# EAGLE design Digital_Output (EAGLE 7.2.0)
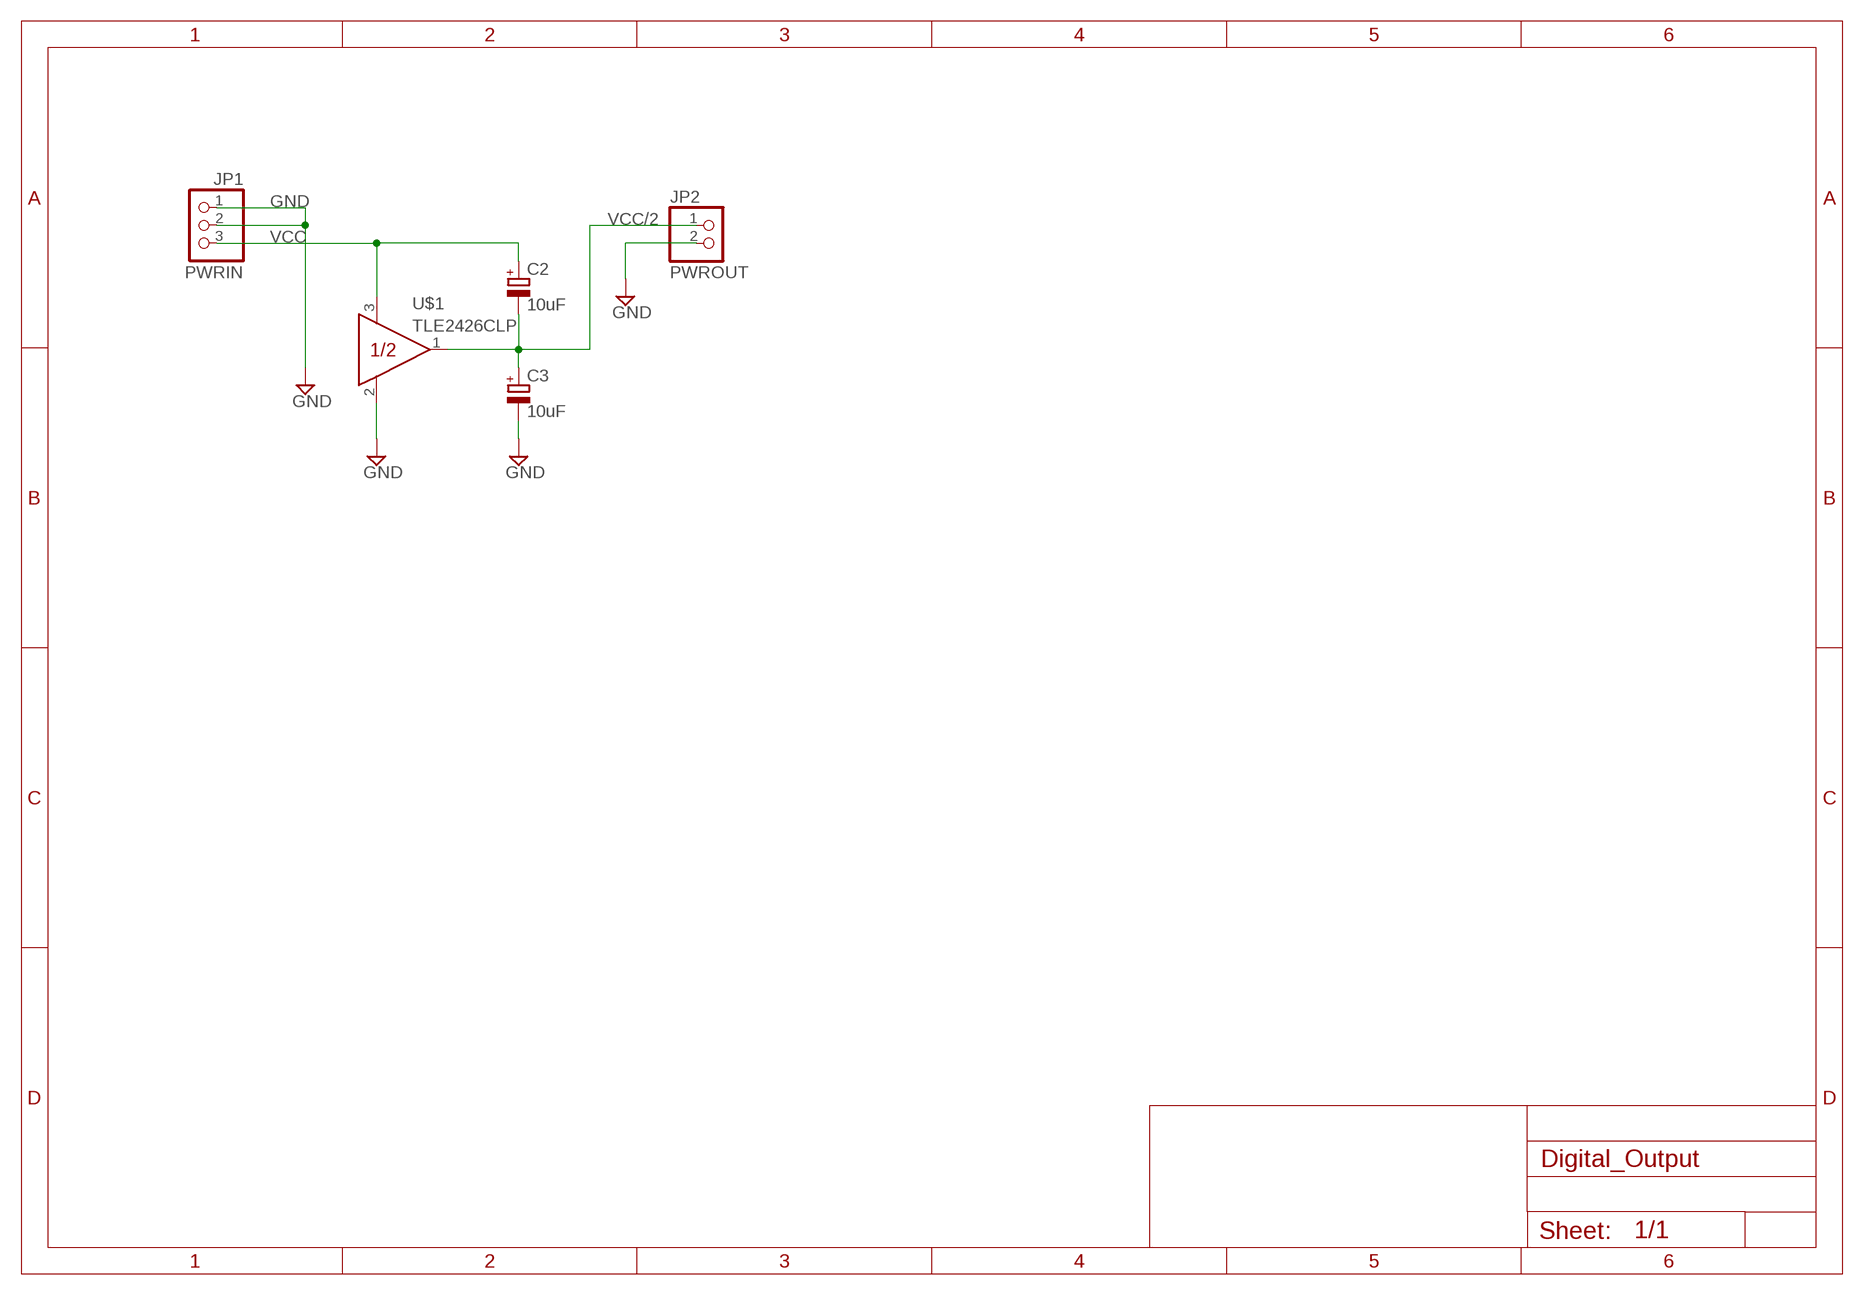
[diagram p0: schematic, sheet 1]

## Parts
C2  10uF  CPOL-EUE2.5-5  [E2,5-5]
C3  10uF  CPOL-EUE2.5-5  [E2,5-5]
JP1  PWRIN  PINHD-1X3  [1X03]
JP2  PWROUT  PINHD-1X2  [1X02]
U$1  TLE2426CLP  [TO226AA]

## Nets
GND: C3.- JP1.1 JP1.2 JP2.2 U$1.2(COM)
VCC: C2.+ JP1.3 U$1.3(IN)
VCC/2: C2.- C3.+ JP2.1 U$1.1(OUT)

## Library data of the parts
C2 C3 = rcl:CPOL-EU: POLARIZED CAPACITOR, European symbol
JP1 = pinhead:PINHD-1X3: PIN HEADER
JP2 = pinhead:PINHD-1X2: PIN HEADER
U$1 = tle2426:TLE2426*L: Texas Instruments "rail splitter". No noise-reduction pin.

## Board
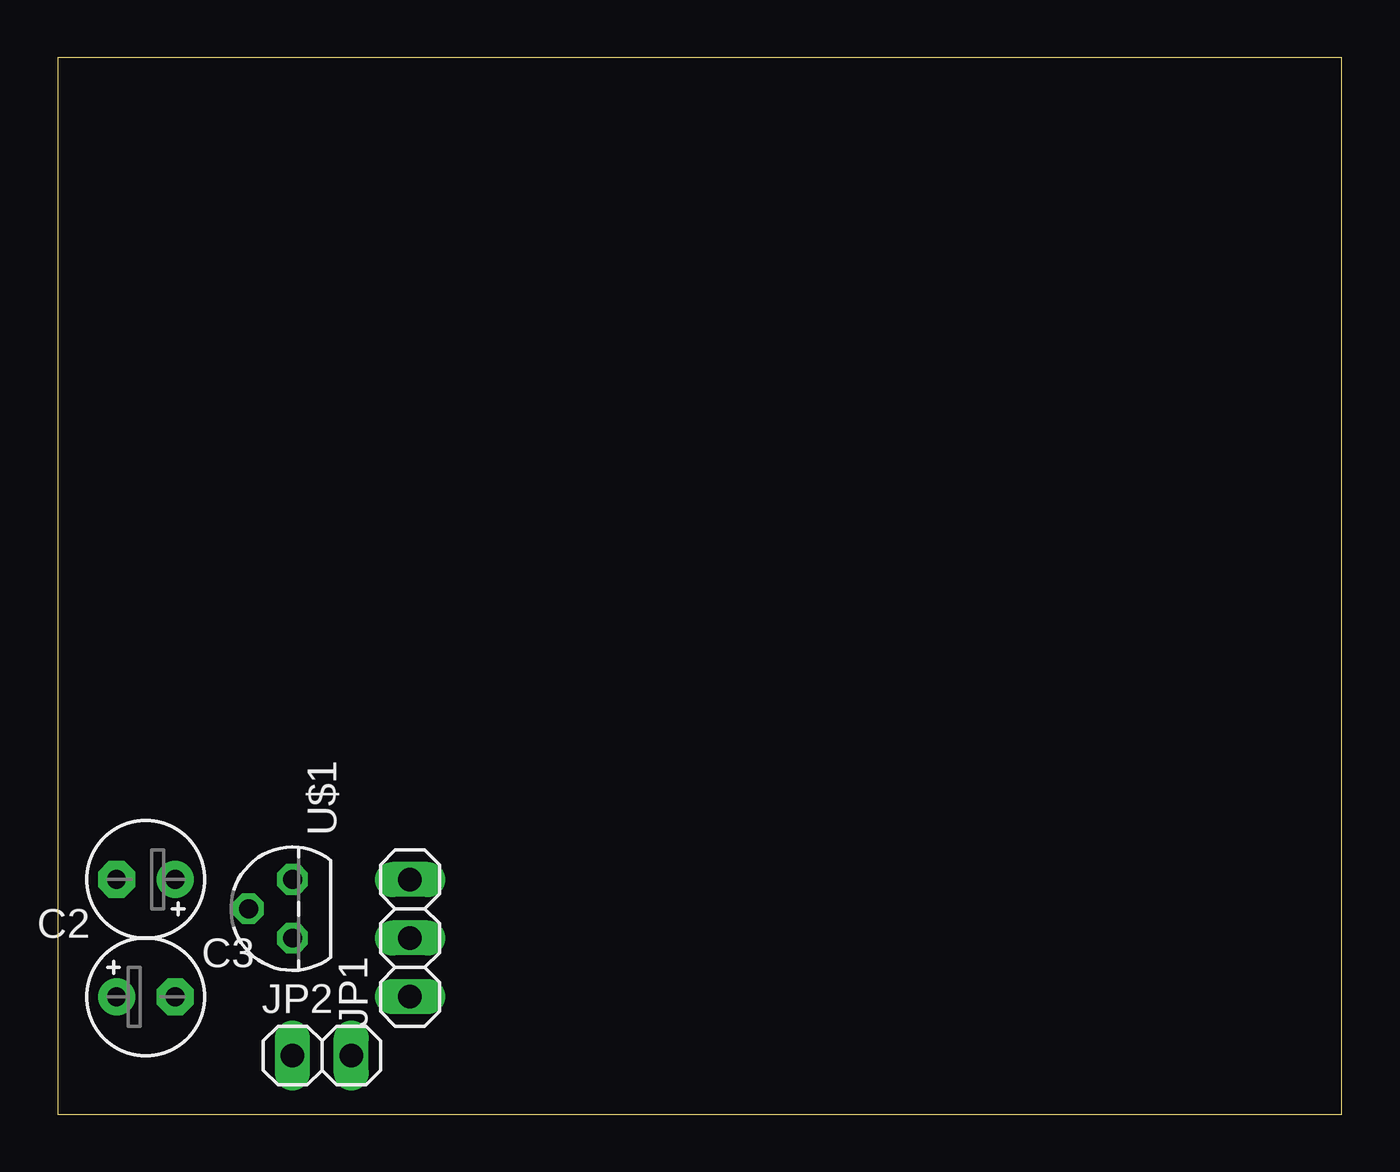
[diagram p1: board, top side]
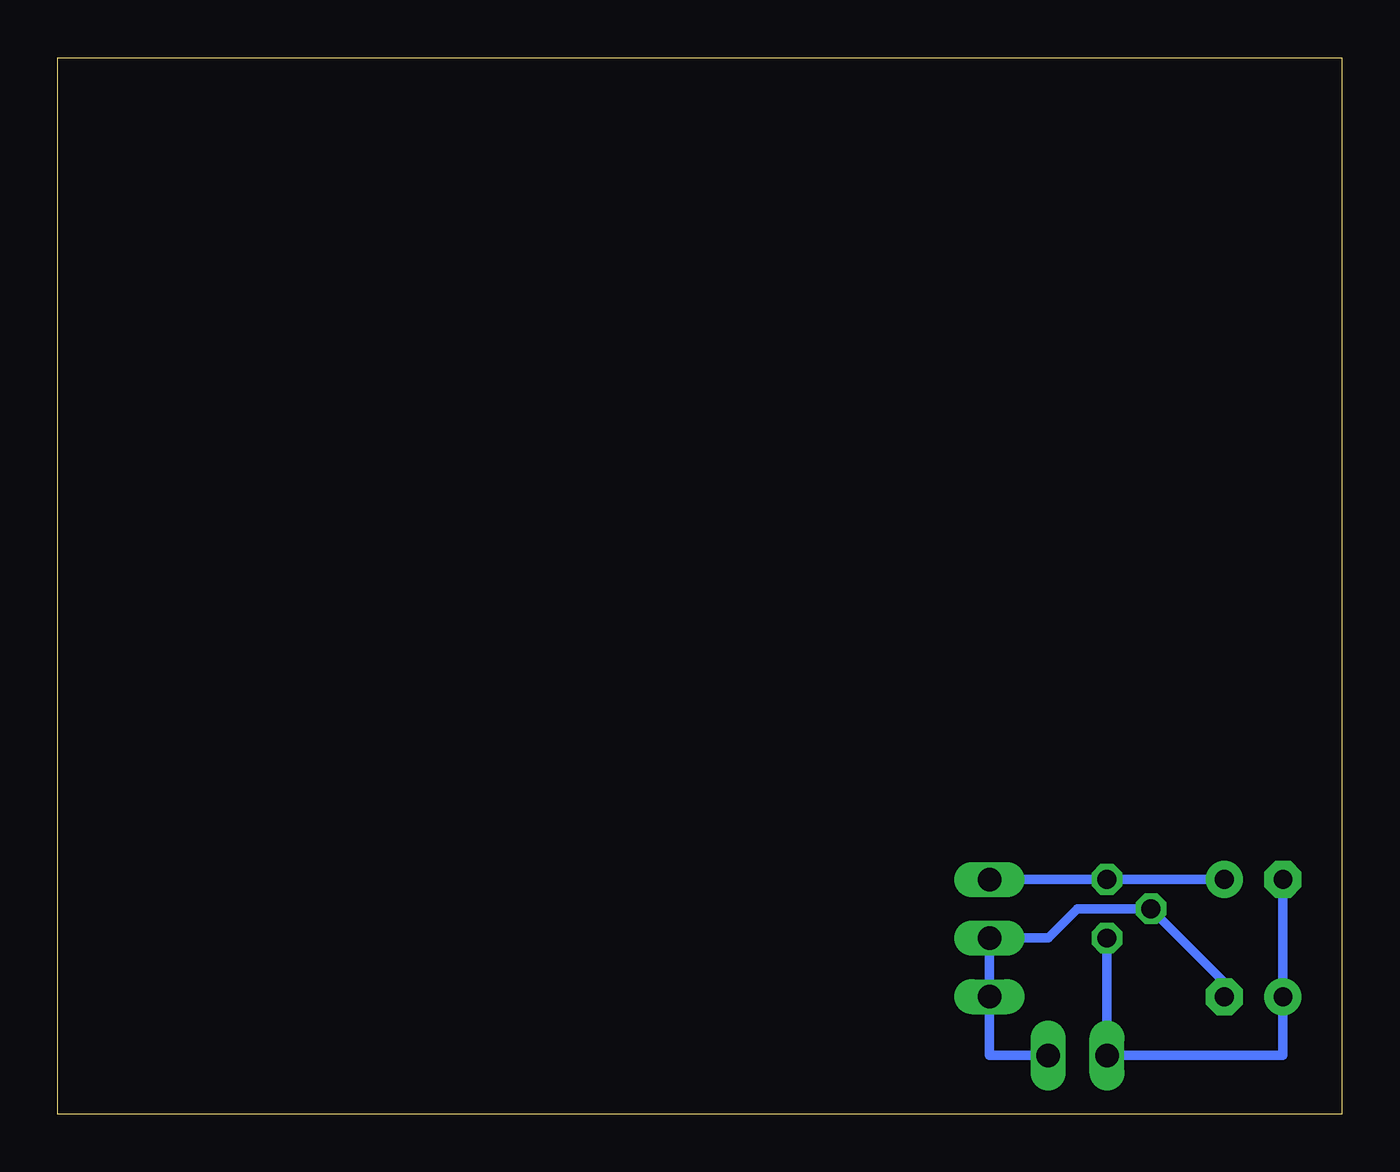
[diagram p2: board, bottom side, seen from below]

Size 55.55 x 45.71 mm. Coordinates in mm from the lower left corner, seen from the top.
Outline: 0,0 55.55,0 55.55,45.71 0,45.71 0,0
Copper layers (1*16): Top 0.035mm / dielectric 1.5mm / Bottom 0.035mm
Design rules "default": minimum track width 10mil, minimum drill 24mil, track to track 8mil, track to pad 8mil, pad to pad 8mil, via to via 8mil, smd to smd 8mil, copper to edge 40mil, drill to drill 8mil, minimum pad ring 10mil, minimum via ring 8mil, stop-mask expansion 4mil, vias tented up to drill 0mil, thermal gap 10mil

### Footprints (pad centres in the part's own frame; a part is rotated, then mirrored left to right if it is on the bottom)
E2,5-5 = drill 0.813 pad 1.6: + -1.27,0 | drill 0.813 pad 1.6 octagon: - 1.27,0
1X03 = drill 1.016 long: 1 -2.54,0; 2 0,0; 3 2.54,0
1X02 = drill 1.016 long: 1 -1.27,0; 2 1.27,0
TO226AA = drill 0.813 octagon: 1 -1.27,0; 2 0,1.905; 3 1.27,0

### Placement (x,y rotation side)
C2  3.81,10.16 180 top
C3  3.81,5.08 0 top
JP1  15.24,7.62 90 top
JP2  11.43,2.54 0 top
U$1  10.16,8.89 90 top

### Tracks (layer width: path | path; a pad name or v marks a point on that pad's centre or on a via)
GND
  Bottom 0.406: JP2.2 15.24,2.54 JP1.1 JP1.2 12.7,7.62 11.43,8.89 U$1.2 5.08,5.71 C3.-
VCC
  Bottom 0.406: JP1.3 U$1.3 C2.+
VCC/2
  Bottom 0.406: U$1.1 JP2.1 2.54,2.54 C3.+ C2.-